# Altium schematic sheet ASBB_MAX98357.SchDoc
size A4
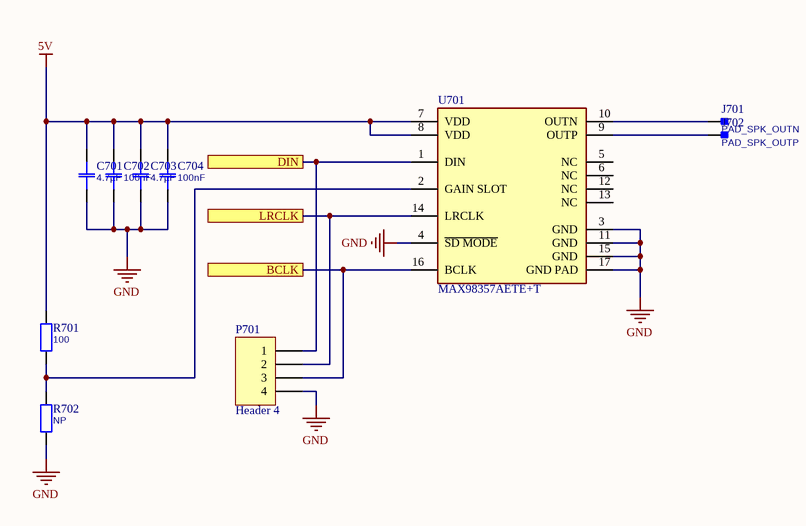
[diagram p0: ASBB_MAX98357.SchDoc]

## Parts
C701  4.7µF  [0603]
C702  100nF  [0603]
C703  4.7µF  [0603]
C704  100nF  [0603]
J701  PAD_SPK_OUTN  [PIN1]
J702  PAD_SPK_OUTP  [PIN1]
P701  Header 4  [HDR1X4]
R701  100  [0603]
R702  NP  [0603]
U701  Part Number: MAX98357AETE+T  [Maxim_Electronics_21-0896_0]  (hidden comment: IC_Maxim_Electronics_MAX98357AETE+T_eec)

## Ports
BCLK, DIN, LRCLK

## Nets
5V: C701.2 C702.2 C703.2 C704.2 R701.2 U701.7(VDD) U701.8(VDD)
GND: C701.1 C702.1 C703.1 C704.1 P701.4 R702.1 U701.3(GND) U701.4(~{SD_MODE}) U701.11(GND) U701.15(GND) U701.17(GND_PAD)
BCLK: P701.3 U701.16(BCLK) ; port BCLK
DIN: P701.1 U701.1(DIN) ; port DIN
LRCLK: P701.2 U701.14(LRCLK) ; port LRCLK
NetJ701_1: J701.1 U701.10(OUTN)
NetJ702_1: J702.1 U701.9(OUTP)
NetR701_1: R701.1 R702.2 U701.2(GAIN_SLOT)

Not connected (* = marked no-connect by the designer): U701 5(NC) 6(NC) 12(NC) 13(NC)

## Library data of the parts
C701-C704 = Capacitor: Partnumber: ?; Value: ?
J701 J702 = Pad 1 Pin: Pad, 1 Pin
P701 = Header 4: Header, 4-Pin; LatestRevisionDate: 17-Jul-2002; LatestRevisionNote: Re-released for DXP Platform.; Publisher: Altium Limited
R701 R702 = Resistor: Partnumber: ?; Value: ?
U701 = IC_Maxim_Electronics_MAX98357AETE+T_eec: IC Amplifier IC 2-Channel (Stereo) Class D 16-TQFN (3x3); Manufacturer: Maxim Electronics; Mfg Package Ident: 21-0896; helpURL: https://upverter.com/upn/revision/0f54a4b5bdb80fd2/; ComponentLink2Description: Datasheet; Temperature: +40°C to +85°C; Package: 21-0896; Supplier 2: Mouser; Price: 1.00367999051; Supplier 1: Digi-Key; ComponentLink1URL: https://upverter.com/upn/revision/0f54a4b5bdb80fd2/; Supplier Part Number 2: 700-MAX98357AETE+T; Supplier Part Number 1: MAX98357AETE+T-ND; ComponentLink1Description: Upverter; ComponentLink2URL: http://datasheets.maximintegrated.com/en/ds/MAX98357A-MAX98357B.pdf; RoHS: TRUE; Mouser Part Number: 700-MAX98357AETE+T; Temperature Range High: +85°C; Digikey Description: IC Amplifier IC 2-Channel (Stereo) Class D 16-TQFN (3x3); Digikey Part Number: MAX98357AETE+T-ND; Lead Free: yes; Temperature Range Low: +40°C